# Altium schematic sheet gps.SchDoc
size 297 x 209 mm
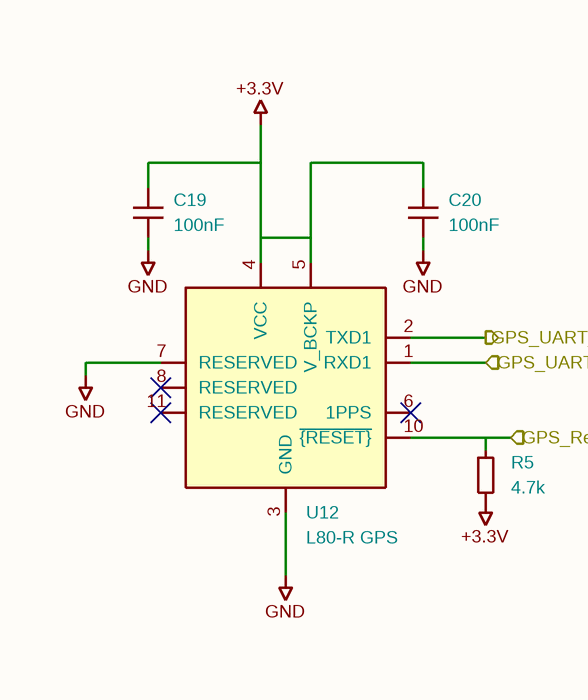
[diagram p0: gps.SchDoc]

## Parts
C19  100nF  [C_0603_1608Metric]
C20  100nF  [C_0603_1608Metric]
R5  4.7k  [R_0603_1608Metric]
U12  L80-R GPS  [Quectel_L80-R]

## Ports
GPS_Reset (in), GPS_UART_RX_Module (in), GPS_UART_TX_Module (out)

## Nets
+3.3V: C19.1 C20.1 R5.2 U12.4(VCC) U12.5(V_BCKP)
GND: C19.2 C20.2 U12.3(GND) U12.7(RESERVED)
GPS_Reset: R5.1 U12.10(~{{RESET}}) ; port GPS_Reset
GPS_UART_RX_Module: U12.1(RXD1) ; port GPS_UART_RX_Module
GPS_UART_TX_Module: U12.2(TXD1) ; port GPS_UART_TX_Module

Not connected (* = marked no-connect by the designer): U12 6(1PPS)* 8(RESERVED)* 9(NC) 11(RESERVED)* 12(GND)

## Notes on the sheet
- 1
- 2
- 3
- 4
- 5
- 6
- A
- B
- C
- D
- Title:
- File: gps.kicad_sch
- Sheet: /
- KiCad E.D.A.  kicad (5.1.4)-1
- Size: A4
- Date:
- Rev:
- Id: 1/1

## Library data of the parts
C19 C20 = C_0603: Value: 100nF; Footprint: Components:C_0603_1608Metric
R5 = R_0603: Value: 4.7k; Footprint: Components:R_0603_1608Metric
U12 = L80-R: Value: L80-R GPS; Footprint: Components:Quectel_L80-R